# EAGLE design DC Motor driver (EAGLE 6.5.0)
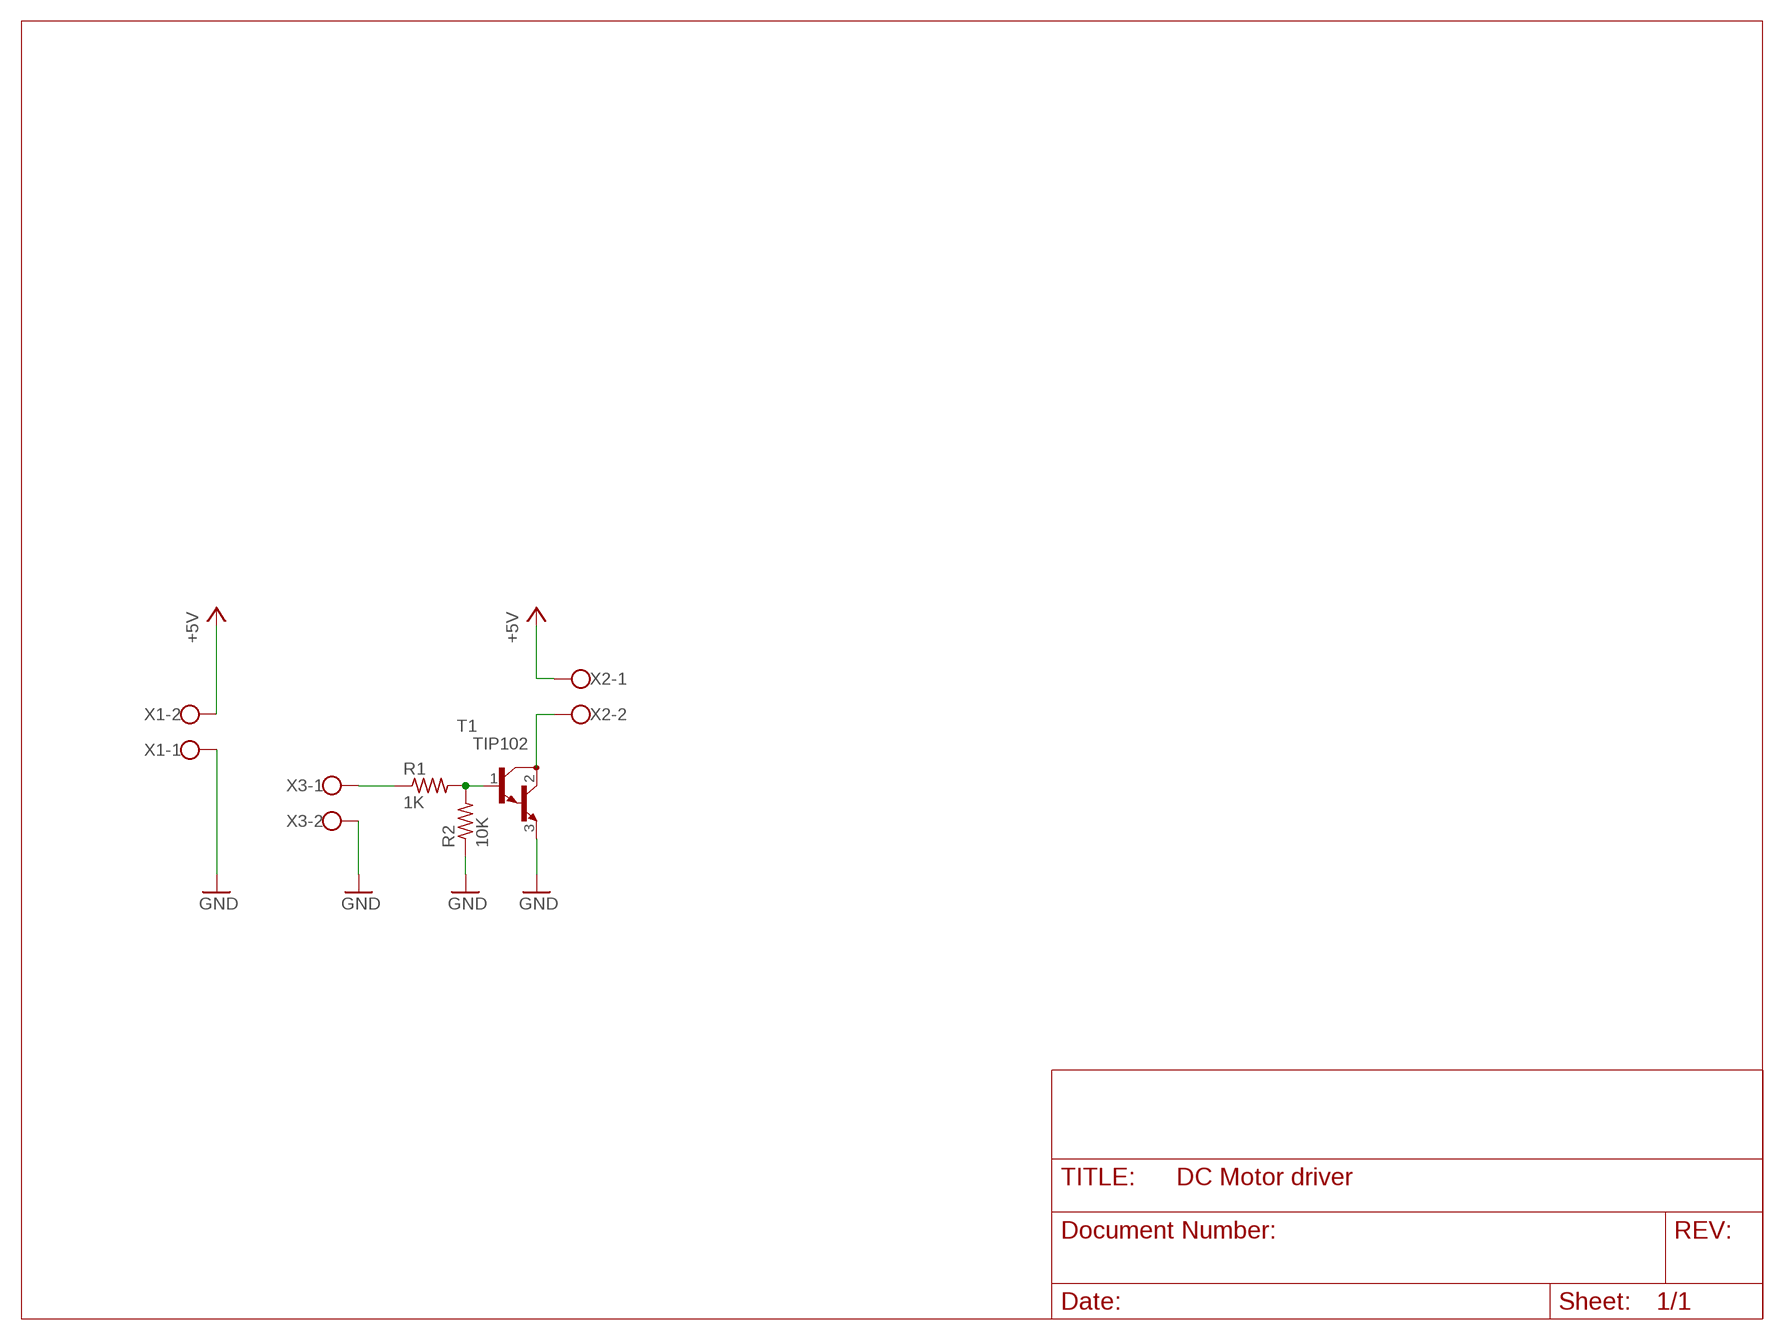
[diagram p0: schematic, sheet 1]

## Parts
R1  1K  R-US_0309/12  [0309/12]
R2  10K  R-US_0309/12  [0309/12]
T1  TIP102  TIP122  [TO220]
X1  W237-102  [W237-102]
X2  W237-102  [W237-102]
X3  W237-102  [W237-102]

## Nets
+5V: X1.2 X2.1
GND: R2.1 T1.3(E) X1.1 X3.2
N$1: T1.2(C) X2.2
N$2: R1.2 R2.2 T1.1(B)
N$3: R1.1 X3.1

## Library data of the parts
R1 R2 = rcl:R-US_: RESISTOR, American symbol
T1 = transistor:TIP122: NPN BIPOLAR DARLINGTON TRANSISTOR
X1-X3 = con-wago-500:W237-102: WAGO SCREW CLAMP; MPN: 237-102; OC_FARNELL: unknown; OC_NEWARK: 70K9898

## Board
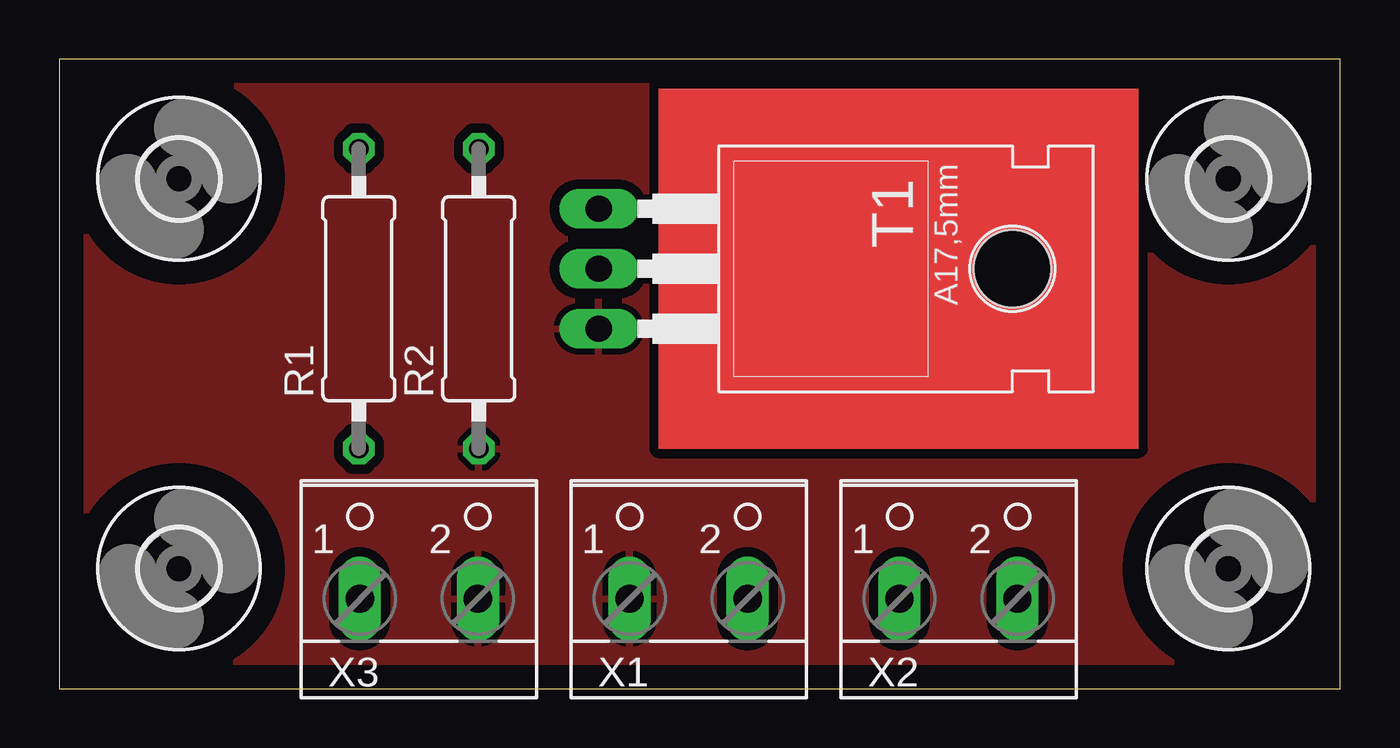
[diagram p1: board, top side]
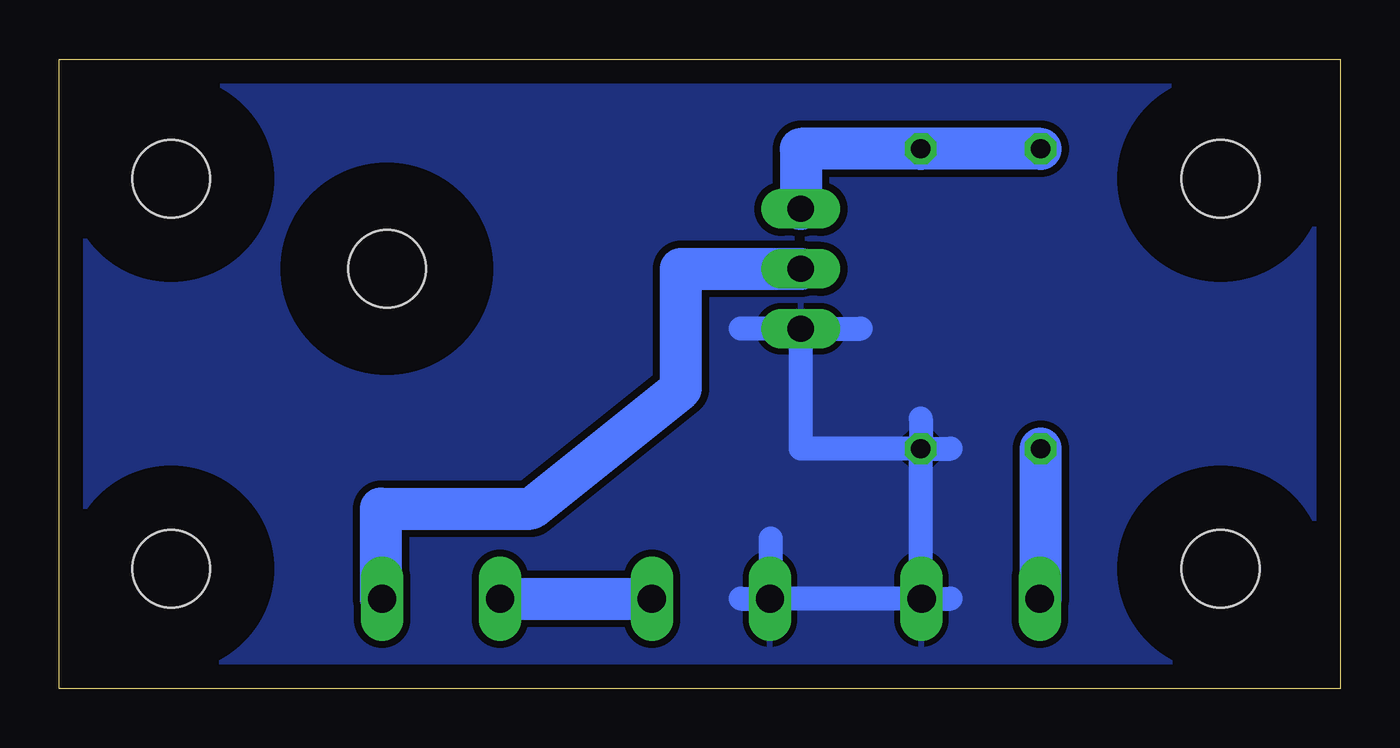
[diagram p2: board, bottom side, seen from below]

Size 54.28 x 26.66 mm. Coordinates in mm from the lower left corner, seen from the top.
Outline: 0,0 54.28,0 54.28,26.66 0,26.66 0,0
Copper layers (1*16): Top 0.035mm / dielectric 1.5mm / Bottom 0.035mm
Design rules "default": minimum track width 10mil, minimum drill 24mil, track to track 8mil, track to pad 8mil, pad to pad 8mil, via to via 8mil, smd to smd 8mil, copper to edge 40mil, drill to drill 8mil, minimum pad ring 10mil, minimum via ring 8mil, stop-mask expansion 4mil, vias tented up to drill 0mil, thermal gap 10mil

### Footprints (pad centres in the part's own frame; a part is rotated, then mirrored left to right if it is on the bottom)
0309/12 = drill 0.813 octagon: 1 -6.35,0; 2 6.35,0
TO220 = drill 1.118 long: 1 -2.54,-6.35; 2 0,-6.35; 3 2.54,-6.35 | hole 3.302: 0,11.176
3,3 = hole 3.3: 0,0
W237-102 = drill 1.194 long: 1 -2.5,-1.27; 2 2.5,-1.27

### Placement (x,y rotation side)
R1  12.7,16.51 90 top
R2  17.78,16.51 90 top
T1  29.21,17.78 270 top
U$1  [3,3]  5.08,5.08 0 top
U$2  [3,3]  49.53,5.08 0 top
U$3  [3,3]  5.08,21.59 0 top
U$4  [3,3]  49.53,21.59 0 top
X1  26.67,5.08 0 top
X2  38.1,5.08 0 top
X3  15.24,5.08 0 top

### Tracks (layer width: path | path; a pad name or v marks a point on that pad's centre or on a via)
+5V
  Bottom 1.778: X2.1 X1.2
GND
  Bottom 1.016: R2.1 22.86,10.16 T1.3 | 17.78,3.81 16.51,3.81 | 17.78,3.81 24.13,3.81 | 25.4,3.81 24.13,3.81 | 24.13,3.81 24.13,2.54 | 24.13,3.81 24.13,6.35 | 17.78,3.81 17.78,2.54 | 17.78,3.81 R2.1 | 17.78,11.43 R2.1 | R2.1 16.51,10.16 | T1.3 20.32,15.24 | T1.3 25.4,15.24
  pour Bottom (isolate 0.305): 0,26.67 54.61,26.67 54.61,0 0,0
  pour Top (isolate 0.406): 0,26.67 54.61,26.67 54.61,0 0,0
N$1
  Bottom 1.778: X2.2 40.64,3.81 40.64,7.62 34.29,7.62 27.94,12.7 27.94,17.78 T1.2
N$2
  Bottom 1.778: R1.2 R2.2 22.86,22.86 T1.1
N$3
  Bottom 1.778: X3.1 12.7,3.81 R1.1
(copper drawn outside any net)
  shapes: Top area x1